# EAGLE design Senior Design PCB (EAGLE 8.7.1)
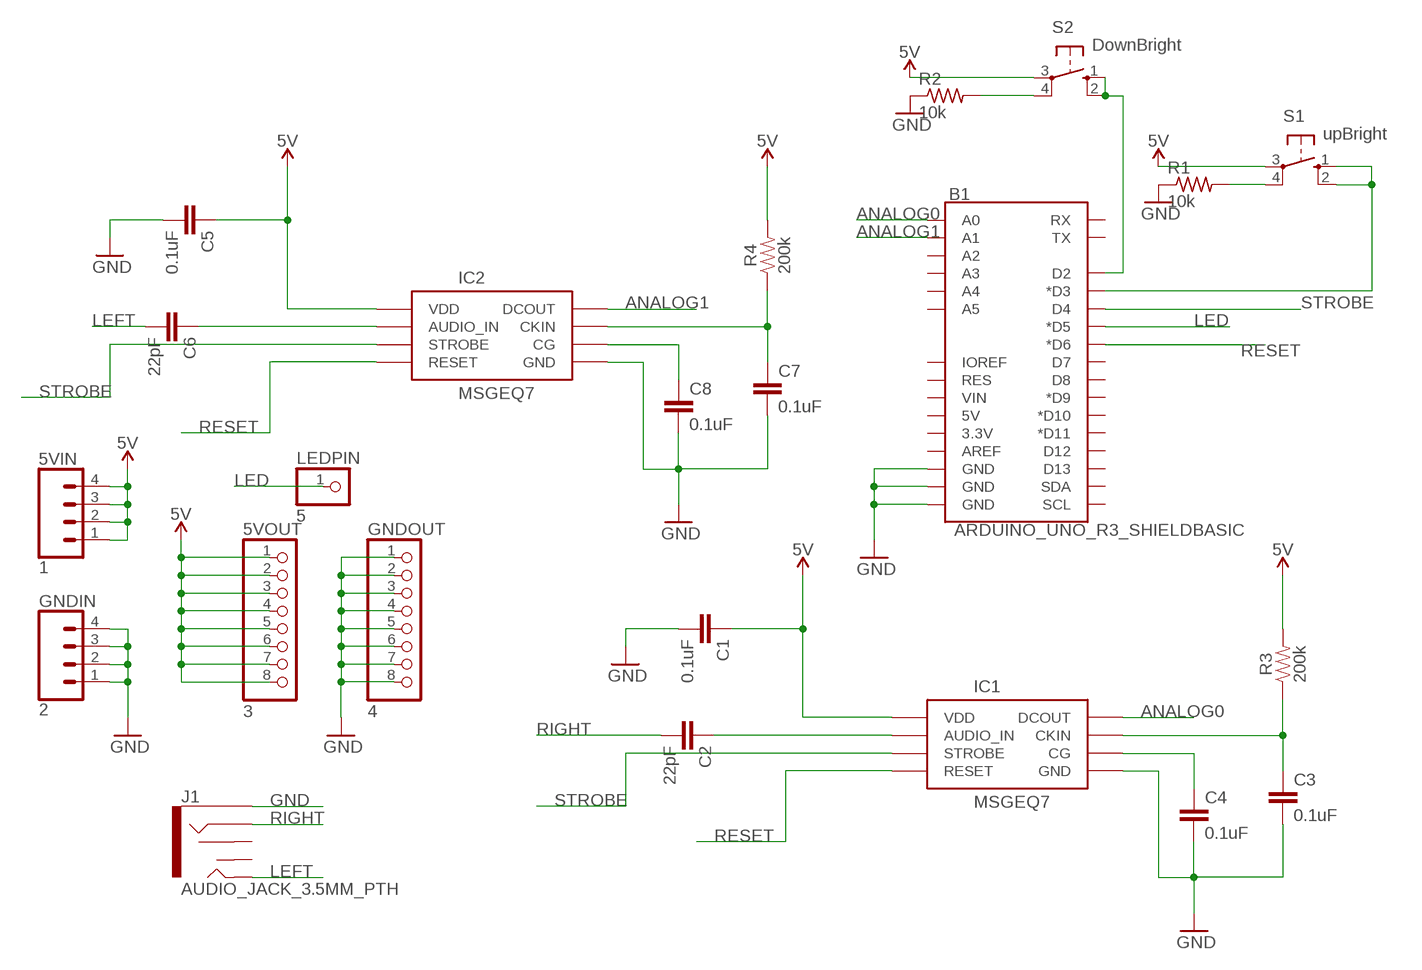
[diagram p0: schematic, sheet 1]

## Parts
5VIN  1  CONN_04  [1X04]
5VOUT  3  PINHD-1X8BIG  [1X08-BIG]
B1  ARDUINO_UNO_R3_SHIELDBASIC  [UNO_R3_SHIELD]
C1  0.1uF  0.1UF-KIT-EZ-50V-20%  [CAP-PTH-SMALL-KIT]
C2  22pF  22PF-PTH-2.54MM-200V-5%  [CAP-PTH-2.54]
C3  0.1uF  0.1UF-KIT-EZ-50V-20%  [CAP-PTH-SMALL-KIT]
C4  0.1uF  0.1UF-KIT-EZ-50V-20%  [CAP-PTH-SMALL-KIT]
C5  0.1uF  0.1UF-KIT-EZ-50V-20%  [CAP-PTH-SMALL-KIT]
C6  22pF  22PF-PTH-2.54MM-200V-5%  [CAP-PTH-2.54]
C7  0.1uF  0.1UF-KIT-EZ-50V-20%  [CAP-PTH-SMALL-KIT]
C8  0.1uF  0.1UF-KIT-EZ-50V-20%  [CAP-PTH-SMALL-KIT]
GNDIN  2  CONN_04  [1X04]
GNDOUT  4  PINHD-1X8BIG  [1X08-BIG]
IC1  MSGEQ7P  MSGEQ7DIL  [DIP08]
IC2  MSGEQ7P  MSGEQ7DIL  [DIP08]
J1  AUDIO_JACK_3.5MM_PTH  [AUDIO-JACK]
LEDPIN  5  PINHD-1X1  [1X01]
R1  10k  R-US_0204/7  [0204/7]
R2  10k  R-US_0204/7  [0204/7]
R3  200k  100KOHM-HORIZ-1/4W-5%  [AXIAL-0.3]
R4  200k  100KOHM-HORIZ-1/4W-5%  [AXIAL-0.3]
S1  upBright  40-XX  [B3F-40XX]
S2  DownBright  40-XX  [B3F-40XX]

## Nets
5V: 5VIN.1 5VIN.2 5VIN.3 5VIN.4 5VOUT.1 5VOUT.2 5VOUT.3 5VOUT.4 5VOUT.5 5VOUT.6 5VOUT.7 5VOUT.8 C1.1 C5.1 IC1.1(VDD) IC2.1(VDD) R3.P$2 R4.P$2 S1.3(P) S2.3(P)
ANALOG0: B1.A0 IC1.3(DCOUT)
ANALOG1: B1.A1 IC2.3(DCOUT)
GND: B1.GND@0(GND) B1.GND@1(GND) B1.GND@2(GND) C1.2 C3.2 C4.2 C5.2 C7.2 C8.2 GNDIN.1 GNDIN.2 GNDIN.3 GNDIN.4 GNDOUT.1 GNDOUT.2 GNDOUT.3 GNDOUT.4 GNDOUT.5 GNDOUT.6 GNDOUT.7 GNDOUT.8 IC1.2(GND) IC2.2(GND) J1.SLEEVE R1.1 R2.1
LED: B1.D5(*D5) LEDPIN.1
LEFT: C6.2 J1.TIP
N$1: R1.2 S1.4(P1)
N$2: R2.2 S2.4(P1)
N$4: B1.D3(*D3) S1.1(S) S1.2(S1)
N$5: C2.1 IC1.5(AUDIO_IN)
N$6: C3.1 IC1.8(CKIN) R3.P$1
N$7: C4.1 IC1.6(CG)
N$8: C6.1 IC2.5(AUDIO_IN)
N$9: C7.1 IC2.8(CKIN) R4.P$1
N$10: C8.1 IC2.6(CG)
N$11: B1.D2 S2.1(S) S2.2(S1)
RESET: B1.D6(*D6) IC1.7(RESET) IC2.7(RESET)
RIGHT: C2.2 J1.RING
STROBE: B1.D4 IC1.4(STROBE) IC2.4(STROBE)
Unconnected: B1.3.3V B1.5V B1.A2 B1.A3 B1.A4 B1.A5 B1.AREF B1.D7 B1.D8 B1.D9(*D9) B1.D10(*D10) B1.D11(*D11) B1.D12 B1.D13 B1.IOREF B1.RES B1.RX B1.SCL B1.SDA B1.TX B1.VIN J1.RSH J1.TSH

## Library data of the parts
5VIN GNDIN = SparkFun-Connectors:CONN_04: Multi connection point. Often used as Generic Header-pin footprint for 0.1 inch spaced/style header connections On any of the 0.1 inch spaced packages, you can populate with these: Break Away Headers - Straight <https://www.sparkfun.com/products/116> (PRT-00116) Break Away Male Headers - Right Angle <https://www.sparkfun.com/products/553> (PRT-00553) Female Headers <https://www.sparkfun.com/products/115> (PRT-00115) Break Away Headers - Machine Pin <https://www.sparkfun.com/products/117> (PRT-00117) Break Away Female Headers - Swiss Machine Pin <https://www.sparkfun.com/products/743> (PRT-00743) For SCREWTERMINALS and SPRING TERMINALS visit here: Screw Terimnals on SparkFun.com <https://www.sparkfun.com/search/results?term=Screw+Terminals> (5mm/3.5mm/2.54mm spacing) This device is also useful as a general connection point to wire up your design to another part of your project. Our various solder wires solder well into these plated through hole pads. Hook-Up Wire - Assortment (Stranded, 22 AWG) <https://www.sparkfun.com/products/11375> (PRT-11375) Hook-Up Wire - Assortment (Solid Core, 22 AWG) <https://www.sparkfun.com/products/11367> (PRT-11367) View the entire wire category on our website here <https://www.sparkfun.com/categories/141> Special notes: Molex polarized connector foot print use with SKU : PRT-08231 with associated crimp pins and housings. 1MM SMD Version SKU: PRT-10208; PROD_ID: CONN-09696
5VOUT GNDOUT = adafruit:PINHD-1X8: PIN HEADER
B1 = SparkFun-Boards:ARDUINO_UNO_R3_SHIELD: Arduino R3 Shield Footprint Shield form compatible with the Arduino Uno R3. SparkFun Products: MG2639 Cellular Shield <https://www.sparkfun.com/products/13120> MIDI Shield <https://www.sparkfun.com/products/12898> R3 Stackable Headers Kit <https://www.sparkfun.com/products/11417>
C1 C3-C5 C8 = SparkFun-Capacitors:0.1UF: 0.1µF ceramic capacitors A capacitor is a passive two-terminal electrical component used to store electrical energy temporarily in an electric field.; PROD_ID: CAP-08370
C2 C6 = SparkFun-Capacitors:22PF: 22pF ceramic capacitors A capacitor is a passive two-terminal electrical component used to store electrical energy temporarily in an electric field.; PROD_ID: CAP-09128
C7 = SparkFun-Capacitors:0.1UF: 0.1µF ceramic capacitors A capacitor is a passive two-terminal electrical component used to store electrical energy temporarily in an electric field.; PROD_ID: CAP-08370; SPICEPREFIX: C
IC1 IC2 = SparkFun-IC-Special-Function:MSGEQ7: 7-band graphic equalizer This IC is for making a 7 band/channel audio spectrometer. There are two versions of this part. The DIP available on the storefront, and the SO used in product. Datasheet <https://www.sparkfun.com/datasheets/Components/General/MSGEQ7.pdf> SparkFun Products Storefront component: Graphic Equalizer Display Filter - MSGEQ7 <https://www.sparkfun.com/products/10468> (COM-10468) SparkFun Spectrum Shield <https://www.sparkfun.com/products/13116> (DEV-13116); PROD_ID: IC-12196
J1 = SparkFun-Connectors:AUDIO_JACK_3.5MM: Audio Jack 3.5mm variants of PTH and SMT stereo audio jack with bypass switches. SparkFun Products: SparkFun SparkPunk Sound Kit <[https://www.sparkfun.com/products/11177]> - PTH MP3 Trigger <https://www.sparkfun.com/products/13720> -3.5mm SMD SparkFun PicoBoard <https://www.sparkfun.com/products/11888>- 2.5mm SMD; PROD_ID: CONN-08774; SF_ID: PRT-08032
LEDPIN = adafruit:PINHD-1X1: Pin header 1x1 for 0.1" spacing With round pins
R1 R2 = adafruit:R-US_: RESISTOR, American symbol
R3 R4 = SparkFun-Resistors:100KOHM: 100kΩ resistor A resistor is a passive two-terminal electrical component that implements electrical resistance as a circuit element. Resistors act to reduce current flow, and, at the same time, act to lower voltage levels within circuits. - Wikipedia; PROD_ID: RES-10686; VALUE: 100k
S1 S2 = adafruit:40-XX: OMRON SWITCH; MF: OMRON COMPONENTS USA; MPN: B3F-4000; OC_FARNELL: 176434; OC_NEWARK: 36K3105

## Board
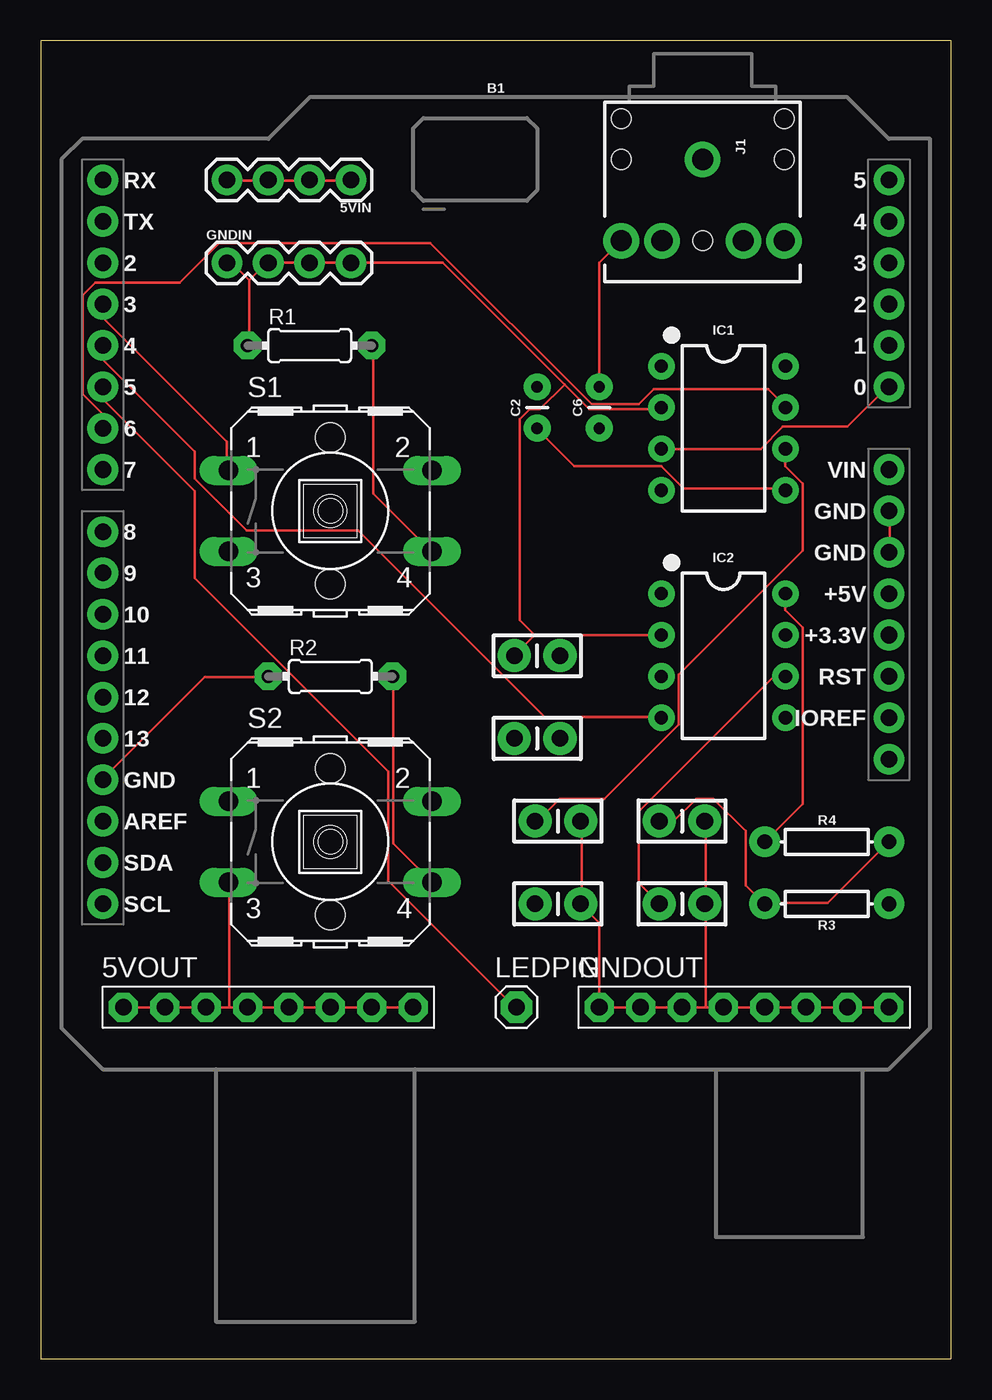
[diagram p1: board, top side]
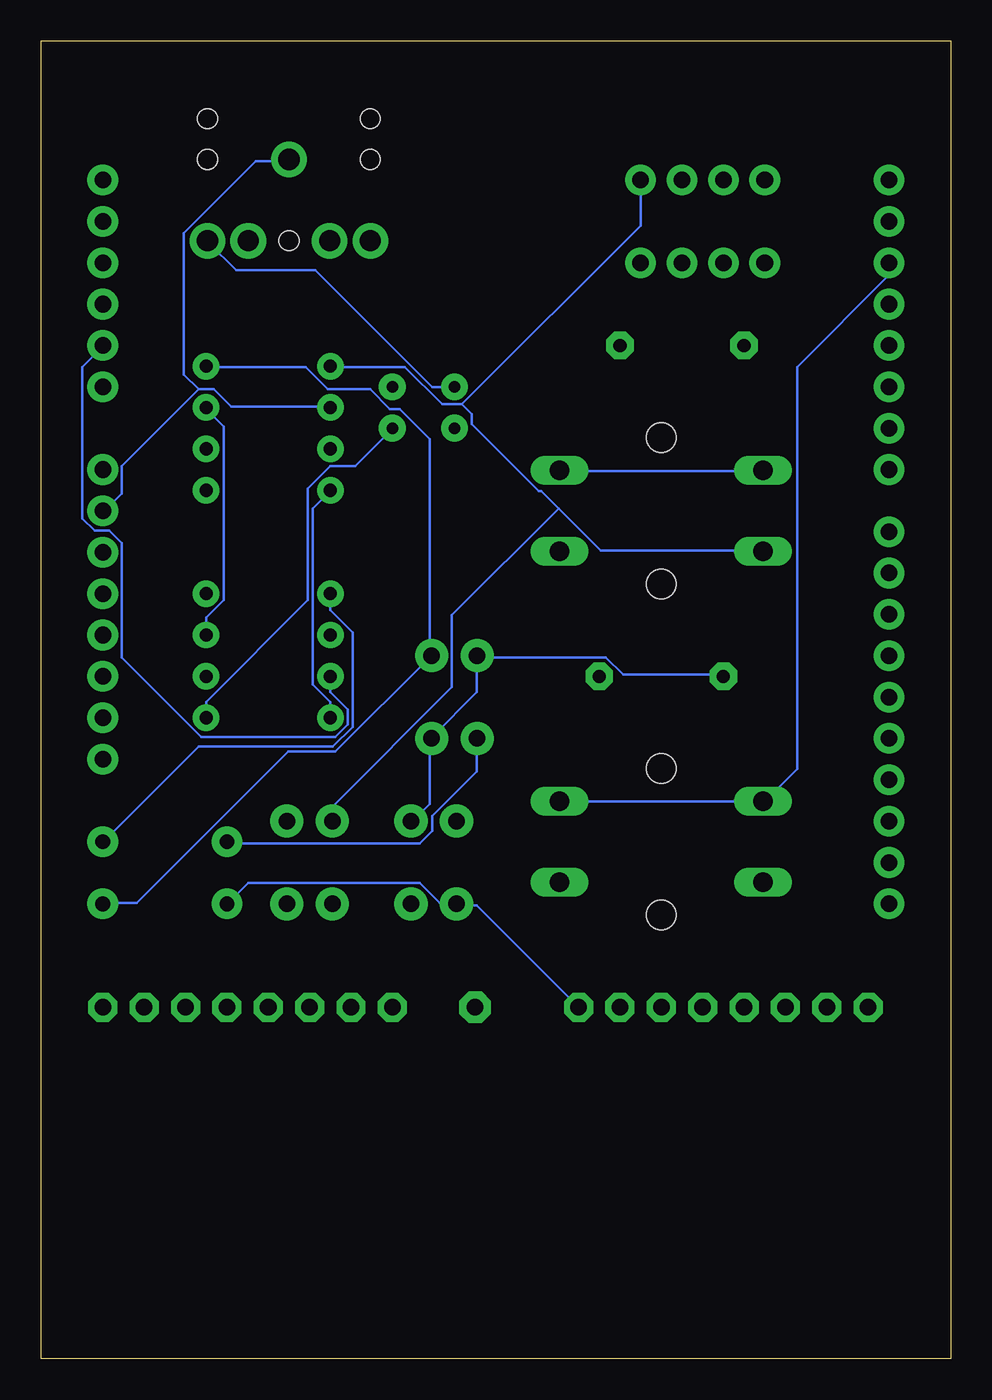
[diagram p2: board, bottom side, seen from below]

Size 55.88 x 80.95 mm. Coordinates in mm from the lower left corner, seen from the top.
Outline: 0,80.95 0,0 55.88,0 55.88,80.95 0,80.95
Copper layers (1*16): Top 0.035mm / dielectric 1.5mm / Bottom 0.035mm
Design rules "default": minimum track width 6mil, minimum drill 0.35mm, track to track 6mil, track to pad 6mil, pad to pad 6mil, via to via 6mil, smd to smd 6mil, copper to edge 40mil, drill to drill 6mil, minimum pad ring 10mil, minimum via ring 8mil, stop-mask expansion 4mil, vias tented up to drill 0mil, thermal gap 10mil

### Footprints (pad centres in the part's own frame; a part is rotated, then mirrored left to right if it is on the bottom)
1X04 = drill 1.016 pad 1.88: 1 0,0; 2 2.54,0; 3 5.08,0; 4 7.62,0
1X08-BIG = drill 1.016 pad 1.778 octagon: 1 -8.89,0; 2 -6.35,0; 3 -3.81,0; 4 -1.27,0; 5 1.27,0; 6 3.81,0; 7 6.35,0; 8 8.89,0
UNO_R3_SHIELD = drill 1.016 pad 1.88: 3.3V 24.13,-2.54; 5V 24.13,0; A0 24.13,12.7; A1 24.13,15.24; A2 24.13,17.78; A3 24.13,20.32; A4 24.13,22.86; A5 24.13,25.4; AREF -24.13,-13.97; D2 -24.13,20.32; D3 -24.13,17.78; D4 -24.13,15.24; D5 -24.13,12.7; D6 -24.13,10.16; D7 -24.13,7.62; D8 -24.13,3.81; D9 -24.13,1.27; D10 -24.13,-1.27; D11 -24.13,-3.81; D12 -24.13,-6.35; D13 -24.13,-8.89; GND@0 24.13,2.54; GND@1 24.13,5.08; GND@2 -24.13,-11.43; IOREF 24.13,-7.62; NC 24.13,-10.16; RES 24.13,-5.08; RX -24.13,25.4; SCL -24.13,-19.05; SDA -24.13,-16.51; TX -24.13,22.86; VIN 24.13,7.62
CAP-PTH-SMALL-KIT = drill 1.016 pad 2.032: 1 -1.397,0; 2 1.397,0
CAP-PTH-2.54 = drill 0.7 pad 1.651: 1 -1.27,0; 2 1.27,0
DIP08 = drill 0.813 pad 1.626: 1 -3.81,-3.81; 2 -1.27,-3.81; 3 1.27,-3.81; 4 3.81,-3.81; 5 3.81,3.81; 6 1.27,3.81; 7 -1.27,3.81; 8 -3.81,3.81
AUDIO-JACK = drill 1.3 pad 2.184: RING 5,5; RSH 5,2.5; SLEEVE 0,0; TIP 5,-5; TSH 5,-2.5 | hole 1.2: 0,5; -2.5,5; -2.5,-5; 0,-5; 5,0
1X01 = drill 1.016 pad 1.93 octagon: 1 0,0
0204/7 = drill 0.813 pad 1.676 octagon: 1 -3.81,0; 2 3.81,0
AXIAL-0.3 = drill 0.9 pad 1.88: P$1 -3.81,0; P$2 3.81,0
B3F-40XX = drill 1.194 long: 1 -6.248,2.489; 2 6.248,2.489; 3 -6.248,-2.489; 4 6.248,-2.489 | hole 1.803: 0,-4.496; 0,4.496

### Placement (x,y rotation side)
5VIN  19.05,72.39 180 top
5VOUT  13.97,21.59 0 top
B1  27.94,46.99 0 top
C1  31.75,27.94 0 top
C2  30.48,58.42 90 top
C3  30.48,43.18 180 top
C4  31.75,33.02 0 top
C5  39.37,33.02 0 top
C6  34.29,58.42 90 top
C7  30.48,38.1 0 top
C8  39.37,27.94 0 top
GNDIN  11.43,67.31 0 top
GNDOUT  43.18,21.59 0 top
IC1  41.91,57.15 270 top
IC2  41.91,43.18 270 top
J1  40.64,73.66 270 top
LEDPIN  29.21,21.59 0 top
R1  16.51,62.23 0 top
R2  17.78,41.91 0 top
R3  48.26,27.94 180 top
R4  48.26,31.75 0 top
S1  17.78,52.07 0 top
S2  17.78,31.75 0 top

### Tracks (layer width: path | path; a pad name or v marks a point on that pad's centre or on a via)
5V
  Top 0.152: 5VIN.4 11.43,72.34 13.87,72.34 5VIN.3 14.02,72.34 16.46,72.34 5VIN.2 16.61,72.34 19.05,72.34 5VIN.1 | 5VOUT.1 5VOUT.2 5VOUT.3 11.58,21.59 | 11.58,21.59 5VOUT.4 5VOUT.5 5VOUT.6 5VOUT.7 5VOUT.8 | 11.58,21.59 11.58,29.21 S2.3 | R4.P$2 48.31,27.99 44.5,27.99 R3.P$2 44.35,27.99 43.28,29.06 43.28,32.41 41.3,34.39 40.23,34.39 38.86,33.02 C5.1
  Bottom 0.152: 30.02,58.62 31.24,58.62 33.53,60.91 38.1,60.91 IC1.1 | 30.02,58.62 19.05,69.6 5VIN.1 | 24.08,52.22 25.15,53.29 25.3,53.29 29.41,57.4 29.41,58.01 30.02,58.62 | 24.08,52.22 21.49,49.63 11.58,49.63 S1.3 | 5VOUT.8 29.11,27.84 30.33,27.84 C1.1 30.48,27.99 31.39,27.99 32.61,29.21 43.13,29.21 44.35,27.99 R3.P$2 | IC2.1 38.1,45.97 36.73,44.6 36.73,38.81 37.95,37.59 46.18,37.59 51.97,31.8 R4.P$2 | 24.08,52.22 30.63,45.67 30.63,41.25 37.95,33.93 37.95,33.02 C5.1
ANALOG0
  Top 0.152: IC1.3 44.2,55.88 45.57,57.25 49.53,57.25 51.97,59.69 B1.A0
ANALOG1
  Bottom 0.152: IC2.3 38.1,40.95 37.03,39.88 37.03,38.96 37.8,38.2 46.03,38.2 50.9,43.08 50.9,50.09 51.66,50.85 52.58,50.85 53.34,51.61 53.34,60.91 52.12,62.13 B1.A1
GND
  Top 0.152: 12.8,66.24 12.8,62.28 R1.1 | 12.8,66.24 13.87,67.31 GNDIN.2 GNDIN.3 GNDIN.4 24.69,67.31 32.16,59.84 | GNDIN.1 11.73,67.31 12.8,66.24 | B1.GND@0 52.12,49.63 52.12,52.07 B1.GND@1 | 32.16,59.84 33.68,58.32 38.1,58.32 IC1.2 | GNDOUT.8 GNDOUT.7 GNDOUT.6 GNDOUT.5 GNDOUT.4 40.84,21.59 | C5.2 40.84,33.02 40.84,27.99 C8.2 40.84,27.84 40.84,21.59 | 40.84,21.59 GNDOUT.3 GNDOUT.2 GNDOUT.1 34.29,26.77 33.22,27.84 C1.2 33.22,27.99 33.22,33.02 C4.2 | R2.1 13.87,41.86 10.06,41.86 3.81,35.61 B1.GND@2 | 30.33,44.45 IC2.2 | 30.33,44.45 29.11,43.23 C3.2 | 32.16,59.84 30.63,58.32 30.02,58.32 29.41,57.71 29.41,45.36 30.33,44.45
  Bottom 0.152: 46.18,59.54 45.26,59.54 44.2,58.47 38.1,58.47 IC1.2 | 46.18,59.54 50.9,54.81 50.9,53.14 51.97,52.07 B1.GND@1 | 46.18,59.54 47.09,60.45 47.09,69.14 42.67,73.56 40.69,73.56 J1.SLEEVE | C4.2 33.07,33.02 32,34.09 32,38.05 C7.2 31.85,38.2 29.11,40.95 29.11,43.08 C3.2 28.96,43.08 21.18,43.08 20.12,42.01 14.02,42.01 R2.1
LED
  Top 0.152: B1.D5 3.81,58.93 9.45,53.29 9.45,47.95 21.34,36.07 21.34,29.36 29.11,21.59 LEDPIN.1
LEFT
  Top 0.152: C6.2 34.29,67.31 J1.TIP
N$1
  Top 0.152: R1.2 20.42,62.13 20.42,53.14 23.93,49.63 S1.4
N$2
  Top 0.152: S2.4 21.64,31.65 21.64,41.86 R2.2
N$4
  Top 0.152: B1.D3 3.81,63.96 11.43,56.34 11.43,54.66 S1.1
  Bottom 0.152: S1.1 11.58,54.51 23.93,54.51 S1.2
N$5
  Top 0.152: IC1.5 45.72,53.44 39.47,53.44 38.1,54.81 32.77,54.81 30.48,57.1 C2.1
N$6
  Bottom 0.152: IC1.8 45.72,60.91 39.62,60.91 38.25,59.54 35.66,59.54 34.44,58.32 33.83,58.32 32,56.49 32,43.23 C3.1 32,43.08 37.8,37.29 40.69,37.29 49.99,27.99 51.97,27.99 R3.P$1
N$7
  Top 0.152: IC1.6 45.72,54.81 46.79,53.75 46.79,49.63 39.17,42.01 39.17,38.96 34.59,34.39 31.85,34.39 30.48,33.02 C4.1
N$8
  Bottom 0.152: IC2.5 45.72,40.34 39.47,46.58 39.47,53.44 38.1,54.81 36.58,54.81 34.29,57.1 C6.1
N$9
  Top 0.152: IC2.8 45.72,45.97 46.79,44.91 46.79,34.09 R4.P$1
  Bottom 0.152: C7.1 29.11,38.05 29.11,36.07 31.85,33.33 31.85,32.41 32.61,31.65 44.35,31.65 R4.P$1
N$10
  Top 0.152: IC2.6 45.72,41.86 44.96,41.86 36.73,33.63 36.73,29.21 37.95,27.99 C8.1
N$11
  Bottom 0.152: S2.2 S2.1 11.43,34.24 9.45,36.22 9.45,60.91 3.81,66.55 B1.D2
RESET
  Top 0.152: B1.D6 3.81,58.01 2.59,59.23 2.59,65.33 3.35,66.09 8.53,66.09 10.97,68.53 23.93,68.53 33.83,58.62 36.73,58.62 37.64,59.54 44.65,59.54 45.72,58.47 IC1.7
  Bottom 0.152: IC2.7 45.72,45.52 44.65,46.58 44.65,57.25 45.72,58.32 IC1.7
RIGHT
  Bottom 0.152: C2.2 31.85,59.69 39.01,66.85 43.89,66.85 45.57,68.53 J1.RING
STROBE
  Top 0.152: B1.D4 3.81,61.37 9.45,55.73 9.45,54.05 12.65,50.85 19.51,50.85 30.94,39.42 38.1,39.42 IC2.4
  Bottom 0.152: IC2.4 38.1,40.34 39.17,41.4 39.17,52.22 38.1,53.29 IC1.4